# Altium schematic sheet Sheet1.SchDoc: =GlobalProjectName
size 209 x 297 mm; CheckedBy: Кинчин Е.В.; Author: Кулаков М.И.; DrawnBy: Кулаков М.; SheetNumber: 50; SheetTotal: 66; PageSetup: Record=PageOptions|CenterHorizontal=True|CenterVertical=True|PrintScale=1.00|XCorrection=1.00|YCorrection=1.00|PrintKind=1|BorderSize=5000000|LeftOffset=0|BottomOffset=0|Orientation=2|PaperLength=1000|PaperWidth=1000|Scale=100|PaperSource=15|PrintQuality=1200|MediaType=1|DitherType=10|PaperKind=A3|PrintScaleMode=1; Weight: -; ScaleFactor: 1:1; NormInspection: Ахатова Р.Ф.
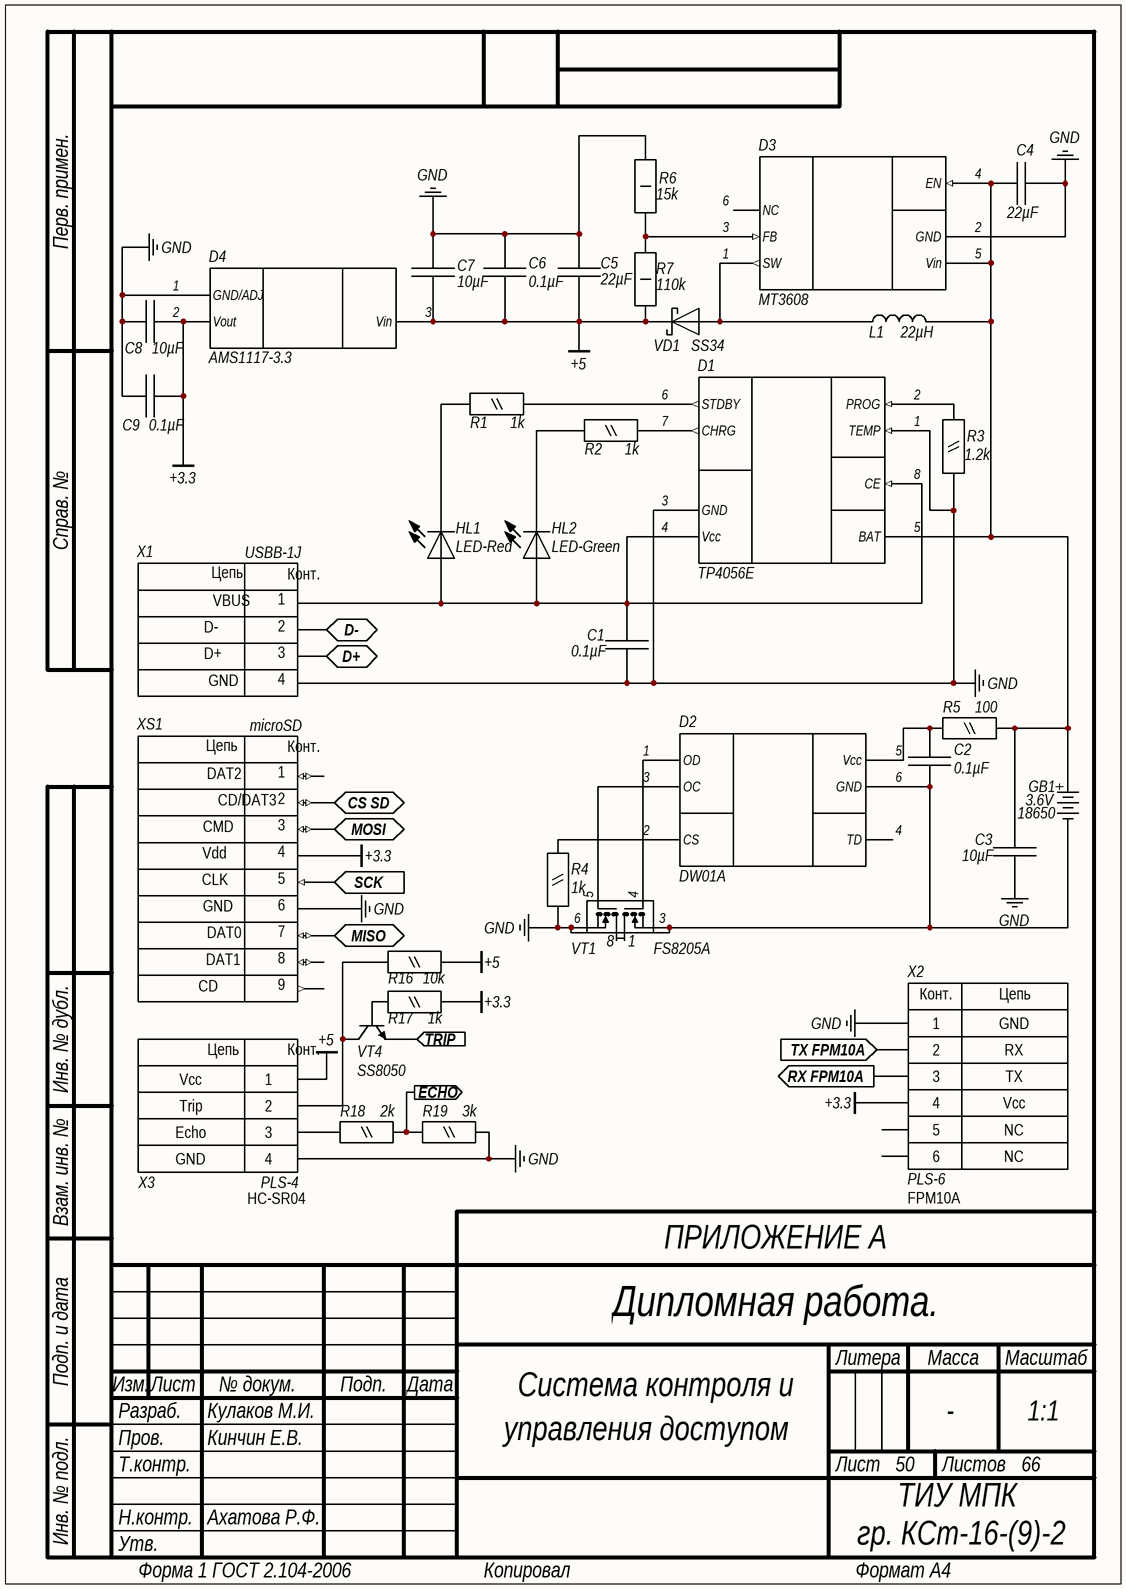
[diagram p0: Sheet1.SchDoc]

## Parts
D1  TP4056E  [U SOIC-8]
D2  DW01A  [U SOT-23-6]
D3  MT3608  [U SOT-23-6]
D4  AMS1117-3.3  [U SOT-223]
GB1  3.6V  Case: 18650  [GB 18650]
HL1  LED-Red  [HL LED SMD 0805]
HL2  LED-Green  [HL LED SMD 0805]
L1  22µH  [L SMD D10]
R1  1k  [R SMD 0805]
R2  1k  [R SMD 0805]
R3  1.2k  [R SMD 0805]
R4  1k  [R SMD 0805]
R5  100  [R SMD 0805]
R6  15k  [R SMD 2512]
R7  110k  [R SMD 2512]
R16  10k  [R SMD 0805]
R17  1k  [R SMD 0805]
R18  2k  [R SMD 0805]
R19  3k  [R SMD 0805]
VD1  SS34  [VD DO-214AB]
VT1  FS8205A  [U TSSOP-8]
VT4  SS8050  [U SOT-23-3]
X1  USBB-1J  [X USBB-1J]
X2  PLS-6  CommentText: FPM10A  [X PLS-6]
X3  PLS-4  CommentText: HC-SR04  [X PLS-4]
XS1  microSD  [X microSD]
С1  0.1µF  [C SMD 0805]
С2  0.1µF  [C SMD 0805]
С3  10µF  [C SMD 0805]
С4  22µF  [C SMD 1206]
С5  22µF  [C SMD 1206]
С6  0.1µF  [C SMD 0805]
С7  10µF  [C SMD 0805]
С8  10µF  [C SMD 0805]
С9  0.1µF  [C SMD 0805]

## Ports
CS SD (bidir), D+ (bidir), D- (bidir), ECHO (out), MISO (bidir), MOSI (bidir), RX FPM10A (out), SCK (in), TRIP (in), TX FPM10A (in)

## Nets
+3.3: D4.2(Vout) R17.2 X2.4 XS1.4(Vdd) С8.2 С9.1
+5: D4.3(Vin) R7.2 R16.2 VD1.2 X3.1 С5.1 С6.1 С7.2
GND: D1.1(TEMP) D1.3(GND) D3.2(GND) D4.1(GND/ADJ) R3.1 R4.1 R6.2 R19.1 VT1.6(S2) VT1.7(S2) X1.4(GND) X2.1 X3.4 XS1.6(GND) С1.2 С3.2 С4.2 С5.2 С6.2 С7.1 С8.1 С9.2
CS SD: XS1.2(CD/DAT3) ; port CS SD
D+: X1.3(D-) ; port D+
D-: X1.2(D-) ; port D-
ECHO: R18.1 R19.2 ; port ECHO
MISO: XS1.7(DATA0) ; port MISO
MOSI: XS1.3(CMD) ; port MOSI
RX FPM10A: X2.3 ; port RX FPM10A
SCK: XS1.5(CLK) ; port SCK
TRIP: VT4.1(E) ; port TRIP
TX FPM10A: X2.2 ; port TX FPM10A
NetD1_2: D1.2(PROG) R3.2
NetD1_4: D1.4(Vcc) D1.8(CE) HL1.1 HL2.1 X1.1(VBUS) С1.1
NetD1_5: D1.5(BAT) D3.4(EN) D3.5(Vin) GB1.2(+) L1.2 R5.2 С3.1 С4.1
NetD1_6: D1.6(STDBY) R1.2
NetD1_7: D1.7(CHRG) R2.2
NetD2_1: D2.1(OD) VT1.4(G1)
NetD2_2: D2.2(CS) R4.2
NetD2_3: D2.3(OC) VT1.5(G2)
NetD2_5: D2.5(Vcc) R5.1 С2.2
NetD2_6: D2.6(GND) GB1.1(-) VT1.2(S1) VT1.3(S1) С2.1
NetD3_1: D3.1(SW) L1.1 VD1.1
NetD3_3: D3.3(FB) R6.1 R7.1
NetHL1_2: HL1.2 R1.1
NetHL2_2: HL2.2 R2.1
NetR16_1: R16.1 VT4.3(C) X3.2
NetR17_1: R17.1 VT4.2(B)
NetR18_2: R18.2 X3.3

Not connected (* = marked no-connect by the designer): D2 4(TD); D3 6(NC); VT1 1(D1) 8(D2); X2 5 6; XS1 1(DAT2) 8(DATA1)

## Notes on the sheet
- ПРИЛОЖЕНИЕ А
- Дипломная работа.
- Система контроля и
- управления доступом
- ТИУ МПК
  гр. КСт-16-(9)-2
- Перв. примен.
- Справ. №
- Инв. № дубл.
- Взам. инв. №
- Подп. и дата
- Разраб.
- Изм.
- Лист
- № докум.
- Подп.
- Дата
- Литера
- Масса
- Масштаб
- Пров.
- Т.контр.
- Листов
- Инв. № подл.
- Н.контр.
- Утв.
- Форма 1 ГОСТ 2.104-2006
- Копировал
- Формат А4
- (in symbol microSD) Цепь; Конт.; DAT0; DAT1; 9
- (in symbol PLS-4) Цепь; Конт.
- (in symbol PLS-6) Конт.; Цепь
- (in symbol USB B) Цепь; Конт.; D+

## Library data of the parts
D1 = TP4056: Контроллер зарядки батарейки.; Manufacturer: NanJing Top Power ASIC Corp.; Case: SOP-8; ComponentLink1Description: Datasheet; ComponentLink1URL: https://static.chipdip.ru/lib/977/DOC002977110.pdf; Model: TP4056E; ComponentLink2Description: Store; ComponentLink2URL: https://aliexpress.ru/item/32982194674.html?spm=a2g0s.9042311.0.0.75c333eday2Luc; ComponentLink3Description: HelpURL; ComponentLink3URL: *
D2 = DW01: Защита для литиевого аккумулятора.; Manufacturer: Shenzhen H&M Semiconductor Co. Ltd.; Case: SOT-23-6; ComponentLink1Description: Datasheet; ComponentLink1URL: http://hmsemi.com/downfile/DW01A.PDF; Model: DW01A; ComponentLink2Description: Store; ComponentLink2URL: https://aliexpress.ru/item/32984691553.html?spm=a2g0s.9042311.0.0.543133edCjZ4Pa; ComponentLink3Description: HelpURL; ComponentLink3URL: *
D3 = MT3608: Повышающий преобразователь.; Manufacturer: AEROSEMI; Case: SOT-23-6; Model: MT3608; ComponentLink1Description: HelpURL; ComponentLink1URL: *; ComponentLink2Description: Datasheet; ComponentLink2URL: https://prom-electric.ru/media/MT3608.pdf; ComponentLink3Description: Store; ComponentLink3URL: https://smdx.ru/mt3608-b628
D4 = AMS1117: Стабилизатор напряжения.; Manufacturer: Advanced Monolithic Systems; Voltage: 3.3; Model: AMS1117-3.3; ComponentLink1Description: Datasheet; ComponentLink1URL: http://www.advanced-monolithic.com/pdf/ds1117.pdf; Case: SOT-223; ComponentLink2Description: Store; ComponentLink2URL: https://aliexpress.ru/item/4000453803123.html?spm=a2g0s.9042311.0.0.543133edCjZ4Pa
GB1 = Батарея: Manufacturer: LG; Model: LGAAS31865; Capacity: 2200mAh; Voltage: 3.6V; ComponentLink1Description: Store; ComponentLink1URL: *; ComponentLink2Description: HelpURL; ComponentLink2URL: *; ComponentLink3Description: Datasheet; ComponentLink3URL: https://www.tme.eu/Document/851884e7c9339fa73b5bf66663baac51/ACCU-ICR18650-2.2.pdf
HL1 = Светодиод: Manufacturer: Taiwan Oasis Technology Co., Ltd; Color: Red; Case: 0805; Model: LED-Red; ComponentLink1Description: Datasheet; ComponentLink1URL: https://static.chipdip.ru/lib/736/DOC002736052.pdf; ComponentLink2Description: HelpURL; ComponentLink2URL: *; ComponentLink3Description: Store; ComponentLink3URL: https://www.chipdip.ru/product/to-2013bc-mre
HL2 = Светодиод: Manufacturer: Taiwan Oasis Technology Co., Ltd; Color: Green; Case: 0805; Model: LED-Green; ComponentLink1Description: Datasheet; ComponentLink1URL: https://static.chipdip.ru/lib/736/DOC002736052.pdf; ComponentLink2Description: HelpURL; ComponentLink2URL: *; ComponentLink3Description: Store; ComponentLink3URL: https://www.chipdip.ru/product/to-2013bc-mre
L1 = Катушка индуктивности: Manufacturer: Epcos; Model: B82464G4223M; ComponentLink1Description: HelpURL; ComponentLink1URL: *; ComponentLink2Description: Datasheet; ComponentLink2URL: https://static.chipdip.ru/lib/547/DOC005547906.pdf; ComponentLink3Description: Store; ComponentLink3URL: https://www.chipdip.ru/product/b82464g4223m; Case: SMD D10xH4.8; Value: 22µH
R1 R2 R4 R17 = Резистор 0.125 Вт: R; Model: RC0805JR-071KL; Power: 0.125; Case: 0805; Manufacturer: *; ComponentLink1Description: Datasheet; ComponentLink1URL: *; ComponentLink2Description: HelpURL; ComponentLink2URL: *; Value: 1k; ComponentLink3Description: Store; ComponentLink3URL: https://www.chipdip.ru/product0/843440046
R3 = Резистор 0.125 Вт: R; Model: RC0805FR-071K2L; Power: 0.125; Case: 0805; Manufacturer: *; ComponentLink1Description: Datasheet; ComponentLink1URL: *; ComponentLink2Description: HelpURL; ComponentLink2URL: *; Value: 1.2k; ComponentLink3Description: Store; ComponentLink3URL: https://www.chipdip.ru/product0/9000079488
R5 = Резистор 0.125 Вт: R; Model: RC0805FR-07100RL; Power: 0.125; Case: 0805; Manufacturer: *; ComponentLink1Description: Datasheet; ComponentLink1URL: *; ComponentLink2Description: HelpURL; ComponentLink2URL: *; Value: 100; ComponentLink3Description: Store; ComponentLink3URL: https://www.chipdip.ru/product0/9000079462
R6 = Резистор 1 Вт: R; Model: RC2512FR-0715KL; Power: 1; Case: 2512; Manufacturer: *; ComponentLink1Description: Datasheet; ComponentLink1URL: *; ComponentLink2Description: HelpURL; ComponentLink2URL: *; Value: 15k; ComponentLink3Description: Store; ComponentLink3URL: https://www.chipdip.ru/product0/9000190185
R7 = Резистор 1 Вт: R; Model: RC2512FR-07110KL; Power: 1; Case: 2512; Manufacturer: *; ComponentLink1Description: Datasheet; ComponentLink1URL: *; ComponentLink2Description: HelpURL; ComponentLink2URL: *; Value: 110k; ComponentLink3Description: Store; ComponentLink3URL: https://www.chipdip.ru/product0/9000190222
R16 = Резистор 0.125 Вт: R; Model: RC0805FR-0710KL; Power: 0.125; Case: 0805; Manufacturer: *; ComponentLink1Description: Datasheet; ComponentLink1URL: *; ComponentLink2Description: HelpURL; ComponentLink2URL: *; Value: 10k; ComponentLink3Description: Store; ComponentLink3URL: https://www.chipdip.ru/product0/9000079514
R18 = Резистор 0.125 Вт: R; Model: RC0805JR-072KL; Power: 0.125; Case: 0805; Manufacturer: *; ComponentLink1Description: Datasheet; ComponentLink1URL: *; ComponentLink2Description: HelpURL; ComponentLink2URL: *; Value: 2k; ComponentLink3Description: Store; ComponentLink3URL: https://www.chipdip.ru/product0/811944944
R19 = Резистор 0.125 Вт: R; Model: RC0805JR-073KL; Power: 0.125; Case: 0805; Manufacturer: *; ComponentLink1Description: Datasheet; ComponentLink1URL: *; ComponentLink2Description: HelpURL; ComponentLink2URL: *; Value: 3k; ComponentLink3Description: Store; ComponentLink3URL: https://www.chipdip.ru/product0/88534195
VD1 = Диод Шотки: Manufacturer: Vishay General Semiconductor; Case: SMC; Model: SS34; ComponentLink1Description: Datasheet; ComponentLink1URL: https://static.chipdip.ru/lib/501/DOC001501148.pdf; ComponentLink2Description: HelpURL; ComponentLink2URL: *; ComponentLink3Description: Store; ComponentLink3URL: https://www.chipdip.ru/product/ss34-5
VT1 = FS8205: Транзисторная сборка. Если корпус SOIC-8, то смотри подробное условное обозначение. Пины 2 и 5 находятся по середине, в внутренней схеме они соеденины.; Manufacturer: Fortune Semiconductor Corp.; Model: FS8205A; Case: TSSOP-8; ComponentLink1Description: Datasheet; ComponentLink1URL: https://www.ic-fortune.com/upload/Download/FS8205A-DS-12_EN.pdf; ComponentLink2Description: Detailed symbol; ComponentLink2URL: https://go-radio.ru/images/8205a.png; ComponentLink3Description: Store; ComponentLink3URL: https://aliexpress.ru/item/4000453813065.html?spm=a2g0s.9042311.0.0.75c333eday2Luc; ComponentLink4Description: HelpURL; ComponentLink4URL: *
VT4 = Биполярный Транзистор: Manufacturer: Hottech; Model: SS8050; Case: SOT-23-3; ComponentLink1Description: Datasheet; ComponentLink1URL: https://static.chipdip.ru/lib/210/DOC005210683.pdf; ComponentLink2Description: HelpURL; ComponentLink2URL: *; ComponentLink3Description: Store; ComponentLink3URL: https://www.chipdip.ru/product/ss8050-hottech
X1 = USB B: Manufacturer: Molex; TypeConnector: USB B; Model: USBB-1J; ComponentLink1Description: Store; ComponentLink1URL: https://www.chipdip.ru/product/usbb-1j-ds1099-b; ComponentLink2Description: Datasheet; ComponentLink2URL: *; ComponentLink3Description: HelpURL; ComponentLink3URL: *
X2 = PLS-6: Manufacturer: Connfly; TypeConnector: Connector; VoltageMax: 500VAC; Pitch: 2.54mm; CurrentMax: 3A; Multichannel: 6pin; Text6: NC; Text4: Vcc; Text3: TX; Text1: GND; Text2: RX; Model: PLS-6; ComponentLink1Description: Store; ComponentLink1URL: *; Text5: NC
X3 = PLS-4: Manufacturer: Connfly; TypeConnector: Connector; VoltageMax: 500VAC; Pitch: 2.54mm; CurrentMax: 3A; Multichannel: 4pin; Text4: GND; Text3: Echo; Text1: Vcc; Text2: Trip; Model: PLS-4; ComponentLink1Description: Store; ComponentLink1URL: https://aliexpress.ru/item/1872588324.html?spm=a2g0s.9042311.0.0.264d33edUHMLcH
XS1 = microSD: Слот для карты памяти.; Manufacturer: Molex; TypeConnector: microSD; Model: *; ComponentLink1Description: Store; ComponentLink1URL: https://aliexpress.ru/item/32802051702.html?spm=a2g0s.9042311.0.0.4d6533edTBBY1Q; ComponentLink2Description: Datasheet; ComponentLink2URL: *; ComponentLink3Description: HelpURL; ComponentLink3URL: https://kicad-info.s3-us-west-2.amazonaws.com/original/2X/8/8d1dbfabaa90b65dad4965a185d7e55230d35003.png
С1 = Конденсатор: C; Model: MLCC0.1uFY5V50V+80-20%0805; Voltage: 50; Case: 0805; Manufacturer: *; ComponentLink1Description: Datasheet; ComponentLink1URL: *; ComponentLink2Description: HelpURL; ComponentLink2URL: *; Value: 0.1µF; ComponentLink3Description: Store; ComponentLink3URL: https://www.chipdip.ru/product0/642412305
С2 С6 С9 = Конденсатор: Model: MLCC0.1uFY5V50V+80-20%0805; Voltage: 50; Case: 0805; Manufacturer: *; ComponentLink1Description: Datasheet; ComponentLink1URL: *; ComponentLink2Description: HelpURL; ComponentLink2URL: *; Value: 0.1µF; ComponentLink3Description: Store; ComponentLink3URL: https://www.chipdip.ru/product0/77059545
С3 С7 С8 = Конденсатор: C; Manufacturer: Murata Manufacturing; Model: GRM21BR61C106KE15L; Voltage: 16; Case: 0805; ComponentLink1Description: Datasheet; ComponentLink1URL: https://static.chipdip.ru/lib/428/DOC005428493.pdf; ComponentLink2Description: HelpURL; ComponentLink2URL: *; Value: 10µF; ComponentLink3Description: Store; ComponentLink3URL: https://www.chipdip.ru/product/grm21br61c106ke15l
С4 С5 = Конденсатор: Manufacturer: Murata Manufacturing; Model: GRM31CR61C226KE15L; Voltage: 16; Case: 1206; ComponentLink1Description: Datasheet; ComponentLink2Description: HelpURL; ComponentLink2URL: *; Value: 22µF; ComponentLink3Description: Store
  С4: ComponentLink1URL: https://static.chipdip.ru/lib/428/DOC005428493.pdf; ComponentLink3URL: https://www.chipdip.ru/product/grm31cr61c226ke15l
  С5: ComponentLink1URL: *; ComponentLink3URL: *